# EAGLE design flame-rev-c (EAGLE 5.11)
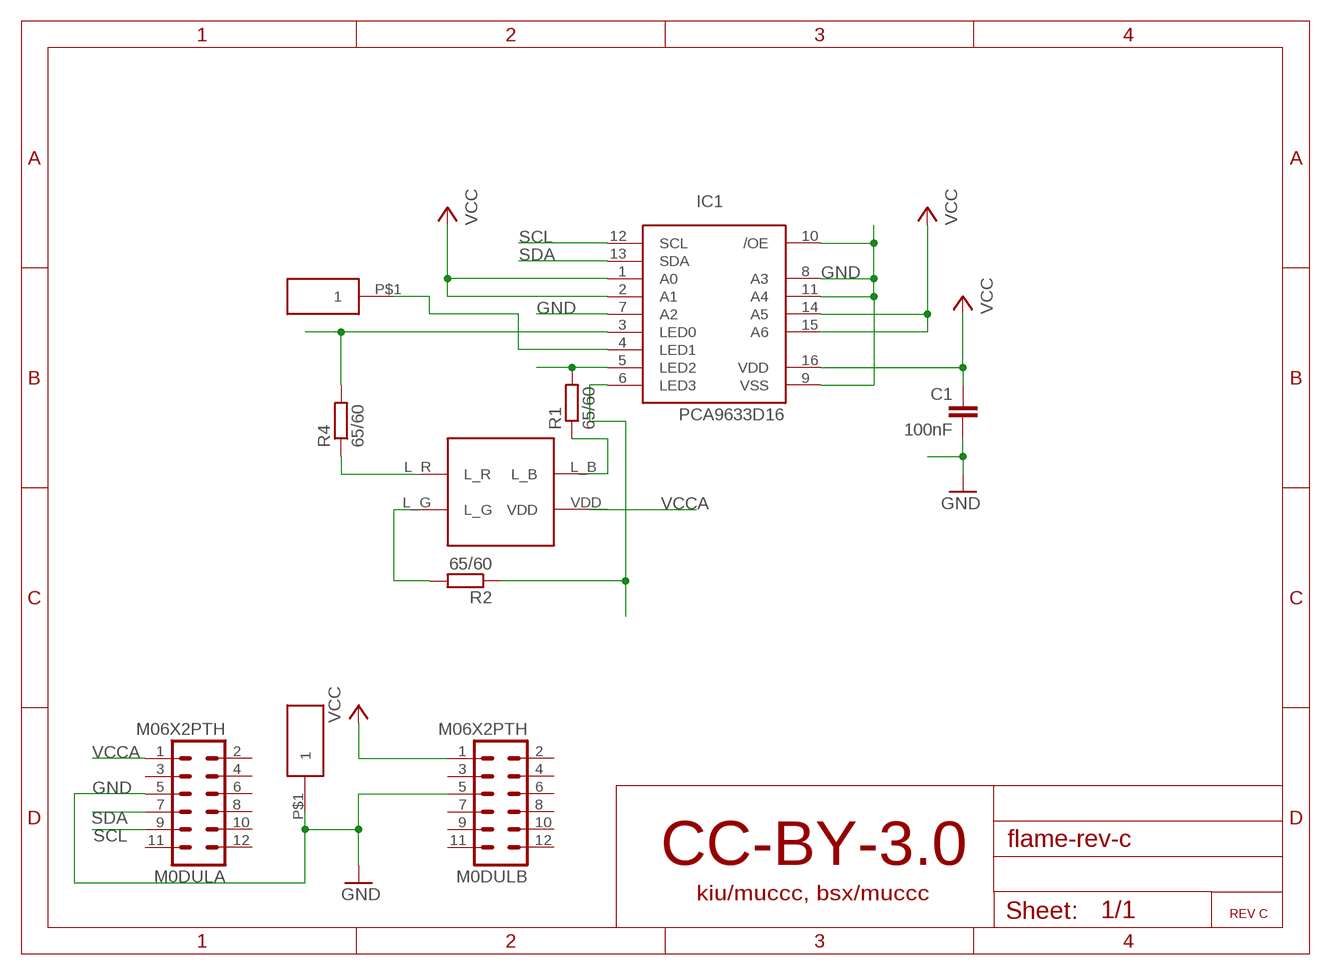
[diagram p0: schematic, sheet 1]

## Parts
C1  100nF  C-EUC0805  [C0805]
IC1  PCA9633D16  [SO16]
M0DULA  M06X2PTH  MA06-2  [MA06-2]
M0DULB  M06X2PTH  MA06-2  [MA06-2]
R1  65/60  R-EU_R0805  [R0805]
R2  65/60  R-EU_R0805  [R0805]
R4  65/60  R-EU_R0805  [R0805]
U$1  LEDADAPTER  [LEDADAPTER]
U$5  TESTPAD  [TESTPAD]
U$6  TESTPAD  [TESTPAD]

## Nets
GND [GND/3V3]: C1.2 IC1.7(A2) IC1.8(A3) IC1.9(VSS) IC1.10(/OE) IC1.11(A4) M0DULA.5 M0DULB.5 U$5.P$1
N$1: IC1.5(LED2) R1.2
N$2: IC1.6(LED3) R2.1
N$3: R2.2 U$1.L_G
N$4: R4.1 U$1.L_R
N$5: IC1.4(LED1) U$6.P$1
N$6: IC1.3(LED0) R4.2
N$8: R1.1 U$1.L_B
SCL: IC1.12(SCL) M0DULA.9
SDA: IC1.13(SDA) M0DULA.7
VCC: C1.1 IC1.1(A0) IC1.2(A1) IC1.14(A5) IC1.15(A6) IC1.16(VDD) M0DULB.1
VCCA: M0DULA.1 U$1.VDD
Unconnected: M0DULA.2 M0DULA.3 M0DULA.4 M0DULA.6 M0DULA.8 M0DULA.10 M0DULA.11 M0DULA.12 M0DULB.2 M0DULB.3 M0DULB.4 M0DULB.6 M0DULB.7 M0DULB.8 M0DULB.9 M0DULB.10 M0DULB.11 M0DULB.12

## Notes on the sheet
- CC-BY-3.0
- kiu/muccc, bsx/muccc
- REV C

## Library data of the parts
C1 = rcl:C-EU: CAPACITOR, European symbol
IC1 = i2c:PCA9633D16
M0DULA M0DULB = con-lstb:MA06-2: PIN HEADER; OC_FARNELL: unknown; OC_NEWARK: unknown
R1 R2 R4 = rcl:R-EU_: RESISTOR, European symbol
U$1 = led:LEDADAPTER
U$5 U$6 = led:TESTPAD

## Net classes
1 FAT: width 0.2 mm, drill 0.4 mm
2 GND/3V3: width 0.2 mm, drill 0.4 mm

## Board
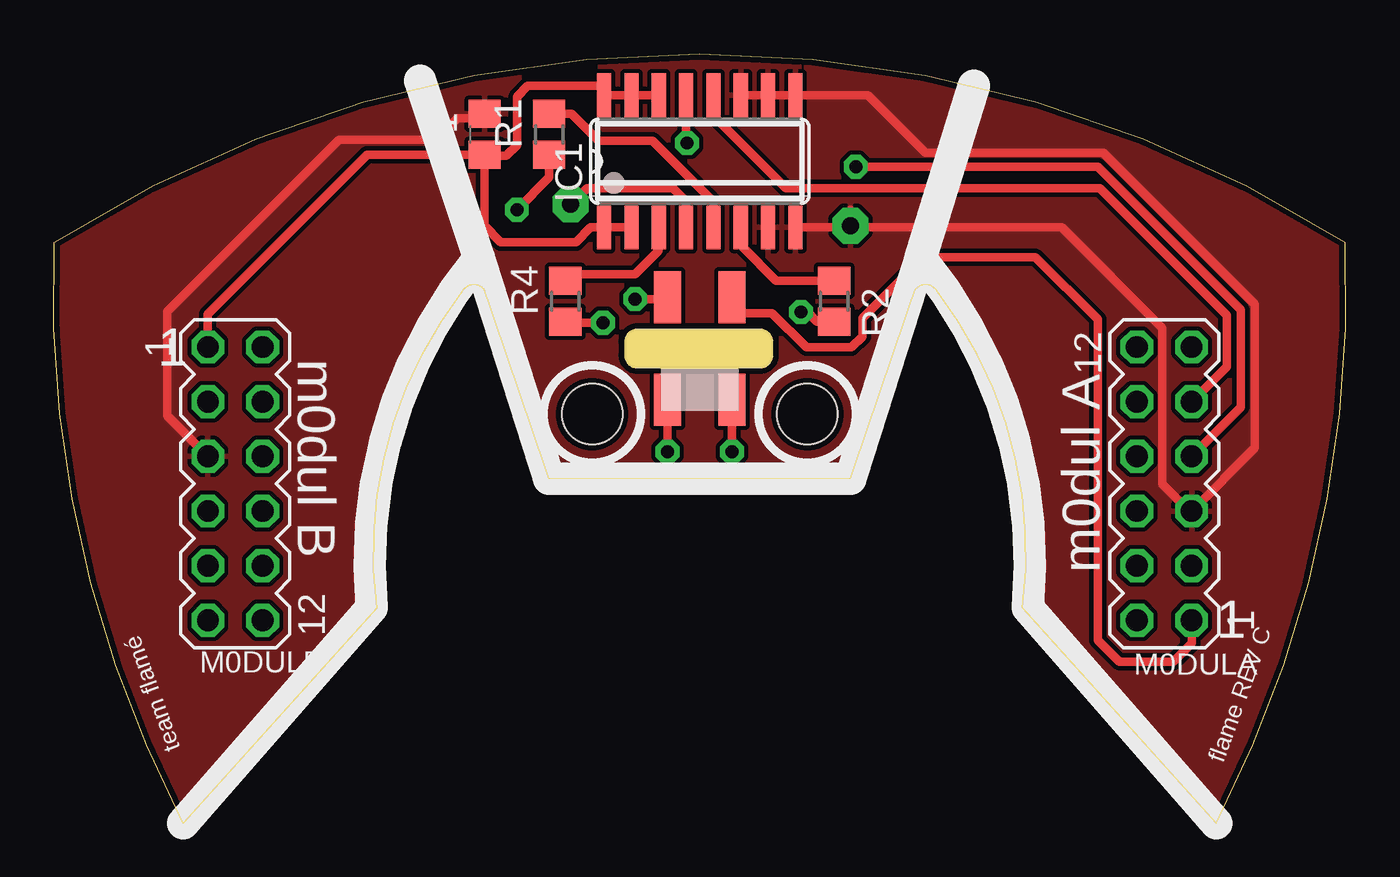
[diagram p1: board, top side]
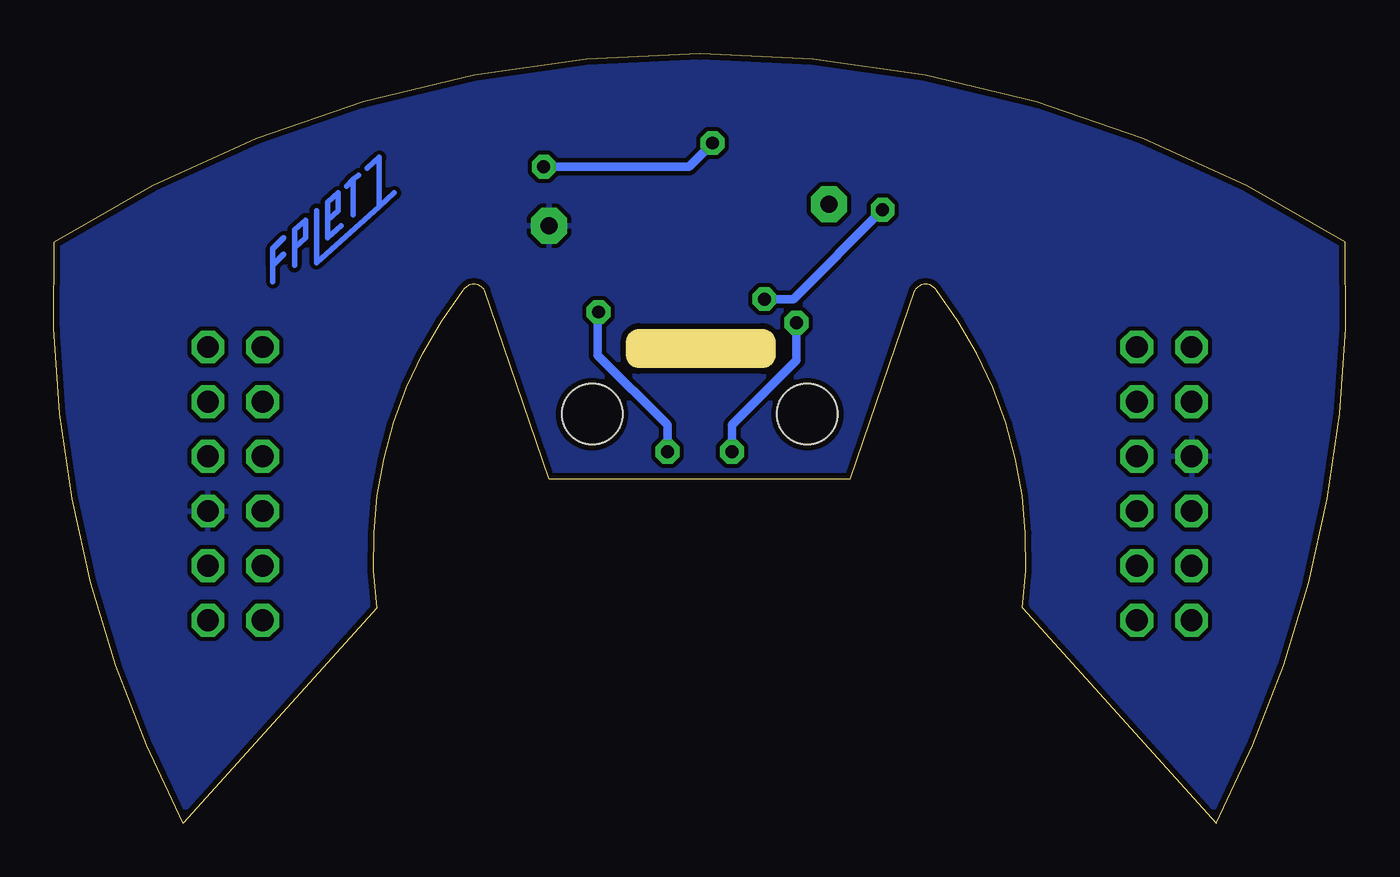
[diagram p2: board, bottom side, seen from below]

Size 60.05 x 35.74 mm. Coordinates in mm from the lower left corner, seen from the top.
Outline: 45.02,10 arc45 41.02,24.75 arc120 40.02,24.75 37.02,16 23.02,16 20.02,24.75 arc120 19.02,24.75 arc45 15.02,10 6.02,0 arc-30 0.02,27 arc-65 60.02,27 arc-30 54.02,0 45.02,10
Outline: 27.12,22.95 arc90 26.52,22.35 26.52,21.75 arc90 27.12,21.15 32.82,21.15 arc90 33.42,21.75 33.42,22.35 arc90 32.82,22.95 27.12,22.95
Copper layers (1*16): Top 0.035mm / dielectric 1.5mm / Bottom 0.035mm
Design rules "PCBCart-Standard *": minimum track width 8mil, minimum drill 0.4mm, track to track 8mil, track to pad 8mil, pad to pad 8mil, via to via 8mil, smd to smd 8mil, copper to edge 0.275mm, drill to drill 8mil, minimum pad ring 8mil, minimum via ring 10mil, stop-mask expansion 3mil, vias tented up to drill 0.7mm, thermal gap 8mil
Holes 2.8 mm at 25.02,19 35.02,19

### Footprints (pad centres in the part's own frame; a part is rotated, then mirrored left to right if it is on the bottom)
C0805 = smd 1.3 x 1.5: 1 -0.95,0; 2 0.95,0
SO16 = smd 0.66 x 2.032: 1 -4.445,-3.073; 2 -3.175,-3.073; 3 -1.905,-3.073; 4 -0.635,-3.073; 5 0.635,-3.073; 6 1.905,-3.073; 7 3.175,-3.073; 8 4.445,-3.073; 9 4.445,3.073; 10 3.175,3.073; 11 1.905,3.073; 12 0.635,3.073; 13 -0.635,3.073; 14 -1.905,3.073; 15 -3.175,3.073; 16 -4.445,3.073
MA06-2 = drill 1.016 octagon: 1 -6.35,-1.27; 2 -6.35,1.27; 3 -3.81,-1.27; 4 -3.81,1.27; 5 -1.27,-1.27; 6 -1.27,1.27; 7 1.27,-1.27; 8 1.27,1.27; 9 3.81,-1.27; 10 3.81,1.27; 11 6.35,-1.27; 12 6.35,1.27
R0805 = smd 1.3 x 1.5: 1 -0.95,0; 2 0.95,0
LEDADAPTER = smd 2.4 x 1.27: L_B 3.18,-1.5; L_G -1.58,-4.5; L_R -1.58,-1.5; VDD 3.18,-4.5
TESTPAD = drill 0.8 pad 1.676 octagon: P$1 0,0

### Placement (x,y rotation side)
C1  20.02,32 90 top
IC1  30.02,30.75 0 top
M0DULA  51.61,15.77 90 top
M0DULB  8.43,15.77 270 top
R1  23.02,32 90 top
R2  36.27,24.25 270 top
R4  23.77,24.25 90 top
U$1  27.02,21.25 90 top
U$5  37.02,27.75 0 top
U$6  24.02,28.75 0 top

### Tracks (layer width: path | path; a pad name or v marks a point on that pad's centre or on a via)
GND
  Top 0.406: M0DULB.5 5.27,18.93 5.27,23.75 13.27,31.75 17.77,31.75 18.77,32.75 19.82,32.75 C1.2 | IC1.9 34.52,33.77 | 35.85,27.68 IC1.8 37.12,27.68 | 52.77,14.5 51.52,15.75 51.52,23 46.85,27.68 37.12,27.68 | IC1.11 IC1.10 IC1.9 | IC1.9 37.85,33.82 40.52,31.15 48.77,31.15 55.82,24.1 55.82,17.44 M0DULA.5 | 37.12,27.68 37.02,27.77 37.02,28.5
  pour Bottom: 60.52,-0.5 -1.73,-0.5 -1.73,36.25 60.52,36.25
  pour Top: 60.52,-0.5 -1.73,-0.5 -1.73,36.25 60.52,36.25
N$1
  Top 0.406: IC1.5 30.66,28.86 27.82,31.7 25.32,31.7 24.07,32.95 R1.2
N$2
  Top 0.406: R2.1 33.57,25.2 32.02,26.75 32.02,27.58 IC1.6
N$3  (via drill 0.6)
  Top 0.406: v31.52,17.25 U$1.L_G | 36.22,23.25 R2.2 35.47,23.3 35.02,23.75 v34.72,23.75
  Bottom 0.406: v34.72,23.75 34.77,23.7 34.77,21.75 31.52,18.5 v31.52,17.25
N$4  (via drill 0.6)
  Top 0.406: v28.52,17.25 U$1.L_R | v25.52,23.25 23.82,23.25 R4.1
  Bottom 0.4: v28.52,17.25 28.52,18.5 25.52,21.5
  Bottom 0.406: 25.52,21.5 v25.52,23.25
N$5
  Top 0.406: IC1.4 29.39,28.89 28.77,29.5 24.77,29.5 U$6.P$1
N$6
  Top 0.406: IC1.3 28.12,26.59 27.02,25.5 24.07,25.5 R4.2 23.47,25.5
N$8  (via drill 0.6)
  Top 0.406: v27.02,24.35 28.44,24.35 U$1.L_B | v21.52,28.5 23.02,30 R1.1
  Bottom 0.406: v27.02,24.35 25.67,24.35 v21.52,28.5
N$11
  Bottom 0.254: 48.85,26.74 48.85,27.57 48.34,28.01 48.34,27.19 48.85,26.74 | 48.85,26.74 48.85,25.92
N$12
  Bottom 0.254: 47.84,28.46 47.84,26.04 44.91,28.65 | 45.49,30.43 44.91,30.93 44.91,28.65 | 44.91,28.65 44.22,29.28
N$13
  Bottom 0.254: 46.12,29.92 46.44,29.6 | 46.12,29.92 46.12,28.27 | 46.12,29.92 45.87,30.11
N$15
  Bottom 0.254: 46.69,27.76 47.33,27.19 47.33,28.01 | 47.33,28.01 47.33,28.84 46.82,29.28 46.82,28.46 47.33,28.01
N$19
  Bottom 0.254: 49.36,27.19 49.87,26.68 49.87,25.92 | 49.87,25.92 49.87,25.15 | 49.36,26.42 49.87,25.92
SCL
  Top 0.406: IC1.12 30.66,32.87 34.02,29.5 48.62,29.5 54.52,23.6 54.52,21.2 52.9,19.58 M0DULA.9
SDA  (via drill 0.6)
  Top 0.406: M0DULA.7 55.17,19.33 55.17,23.85 48.52,30.5 v37.27,30.5 | IC1.13 29.39,31.63 v29.42,31.6
  Bottom 0.406: v37.27,30.5 32.97,30.5 31.57,30.5 30.52,30.5 v29.42,31.6
VCC
  Top 0.406: IC1.2 IC1.1 24.95,27.68 24.27,27 20.77,27 20.02,27.75 C1.1 | IC1.14 IC1.15 IC1.16 25.58,34.25 22.02,34.25 21.52,33.75 21.52,31.5 21.02,31 20.07,31 C1.1 | M0DULB.1 7.16,23.64 14.57,31.05 C1.1
VCCA
  Top 0.406: U$1.VDD 31.52,23.75 31.57,23.7 33.37,23.7 34.97,22.1 37.07,22.1 37.57,22.6 37.57,23.45 40.42,26.3 45.62,26.3 48.52,23.4 48.52,8.5 49.52,7.5 52.02,7.5 52.88,8.36 M0DULA.1

### Text on the board
tSilkscreen: 1 | m0dul B | m0dul A | 1 | team flamé | flame REV C